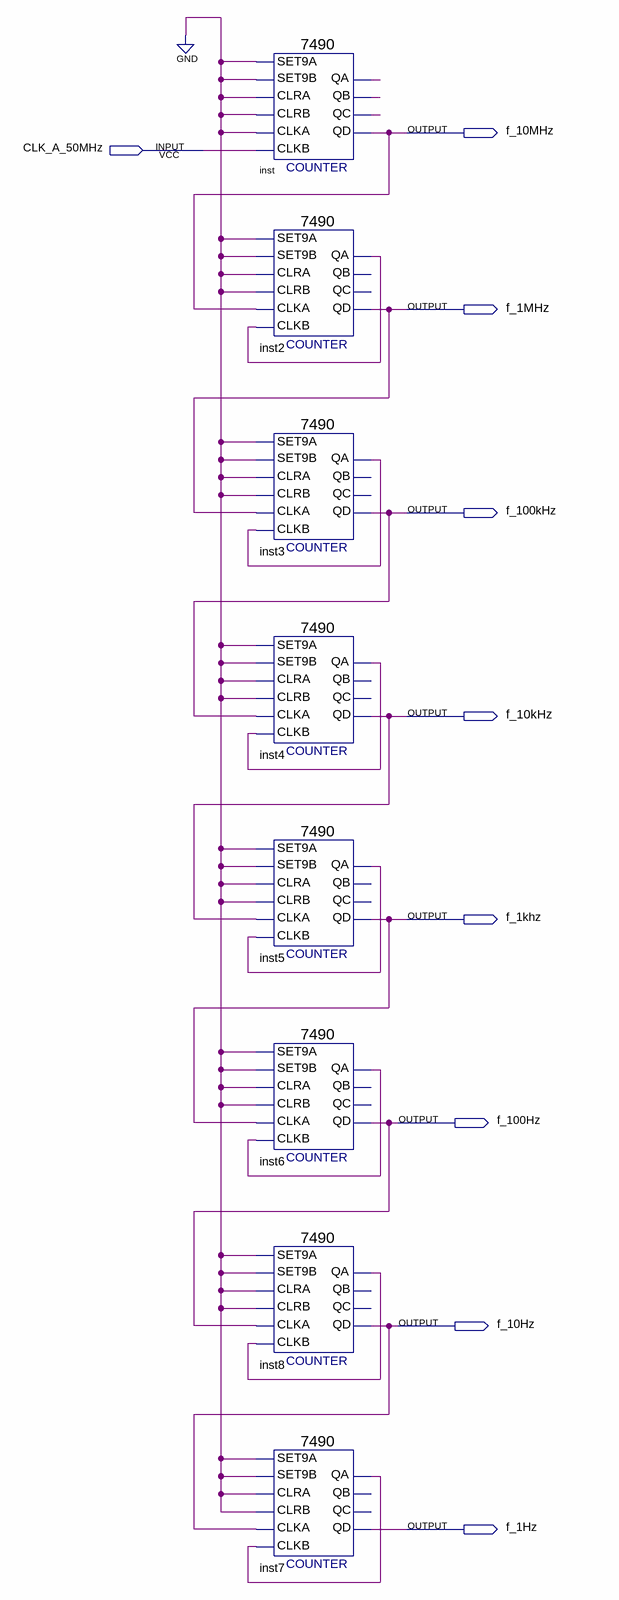
[diagram p0: schematic sheet]
// Quartus schematic dzielnik.bdf as structural Verilog: 8 symbols, 9 pins
module dzielnik (
  input  CLK_A_50MHz,
  output f_10MHz,
  output f_1MHz,
  output f_100kHz,
  output f_10kHz,
  output f_1khz,
  output f_100Hz,
  output f_10Hz,
  output f_1Hz
);

  wire inst2_qa, inst3_qa, inst4_qa, inst5_qa, inst6_qa, inst7_qa, inst8_qa, inst_qa, inst_qb, inst_qc;

  \7490  inst (
    .SET9A(1'b0), .CLRA(1'b0), .SET9B(1'b0), .CLKB(CLK_A_50MHz), .CLKA(1'b0), .CLRB(1'b0), .QD(f_10MHz),
    .QA(inst_qa), .QB(inst_qb), .QC(inst_qc));
  \7490  inst2 (
    .SET9A(1'b0), .CLRA(1'b0), .SET9B(1'b0), .CLKB(inst2_qa), .CLKA(f_10MHz), .CLRB(1'b0), .QD(f_1MHz),
    .QA(inst2_qa));  // open: QB, QC
  \7490  inst3 (
    .SET9A(1'b0), .CLRA(1'b0), .SET9B(1'b0), .CLKB(inst3_qa), .CLKA(f_1MHz), .CLRB(1'b0), .QD(f_100kHz),
    .QA(inst3_qa));  // open: QB, QC
  \7490  inst4 (
    .SET9A(1'b0), .CLRA(1'b0), .SET9B(1'b0), .CLKB(inst4_qa), .CLKA(f_100kHz), .CLRB(1'b0), .QD(f_10kHz),
    .QA(inst4_qa));  // open: QB, QC
  \7490  inst5 (
    .SET9A(1'b0), .CLRA(1'b0), .SET9B(1'b0), .CLKB(inst5_qa), .CLKA(f_10kHz), .CLRB(1'b0), .QD(f_1khz),
    .QA(inst5_qa));  // open: QB, QC
  \7490  inst6 (
    .SET9A(1'b0), .CLRA(1'b0), .SET9B(1'b0), .CLKB(inst6_qa), .CLKA(f_1khz), .CLRB(1'b0), .QD(f_100Hz),
    .QA(inst6_qa));  // open: QB, QC
  \7490  inst8 (
    .SET9A(1'b0), .CLRA(1'b0), .SET9B(1'b0), .CLKB(inst8_qa), .CLKA(f_100Hz), .CLRB(1'b0), .QD(f_10Hz),
    .QA(inst8_qa));  // open: QB, QC
  \7490  inst7 (
    .SET9A(1'b0), .CLRA(1'b0), .SET9B(1'b0), .CLKB(inst7_qa), .CLKA(f_10Hz), .CLRB(1'b0), .QD(f_1Hz),
    .QA(inst7_qa));  // open: QB, QC
endmodule
